# Altium schematic sheet IOs.SchDoc
size A4; SheetNumber: 3; SheetTotal: 3
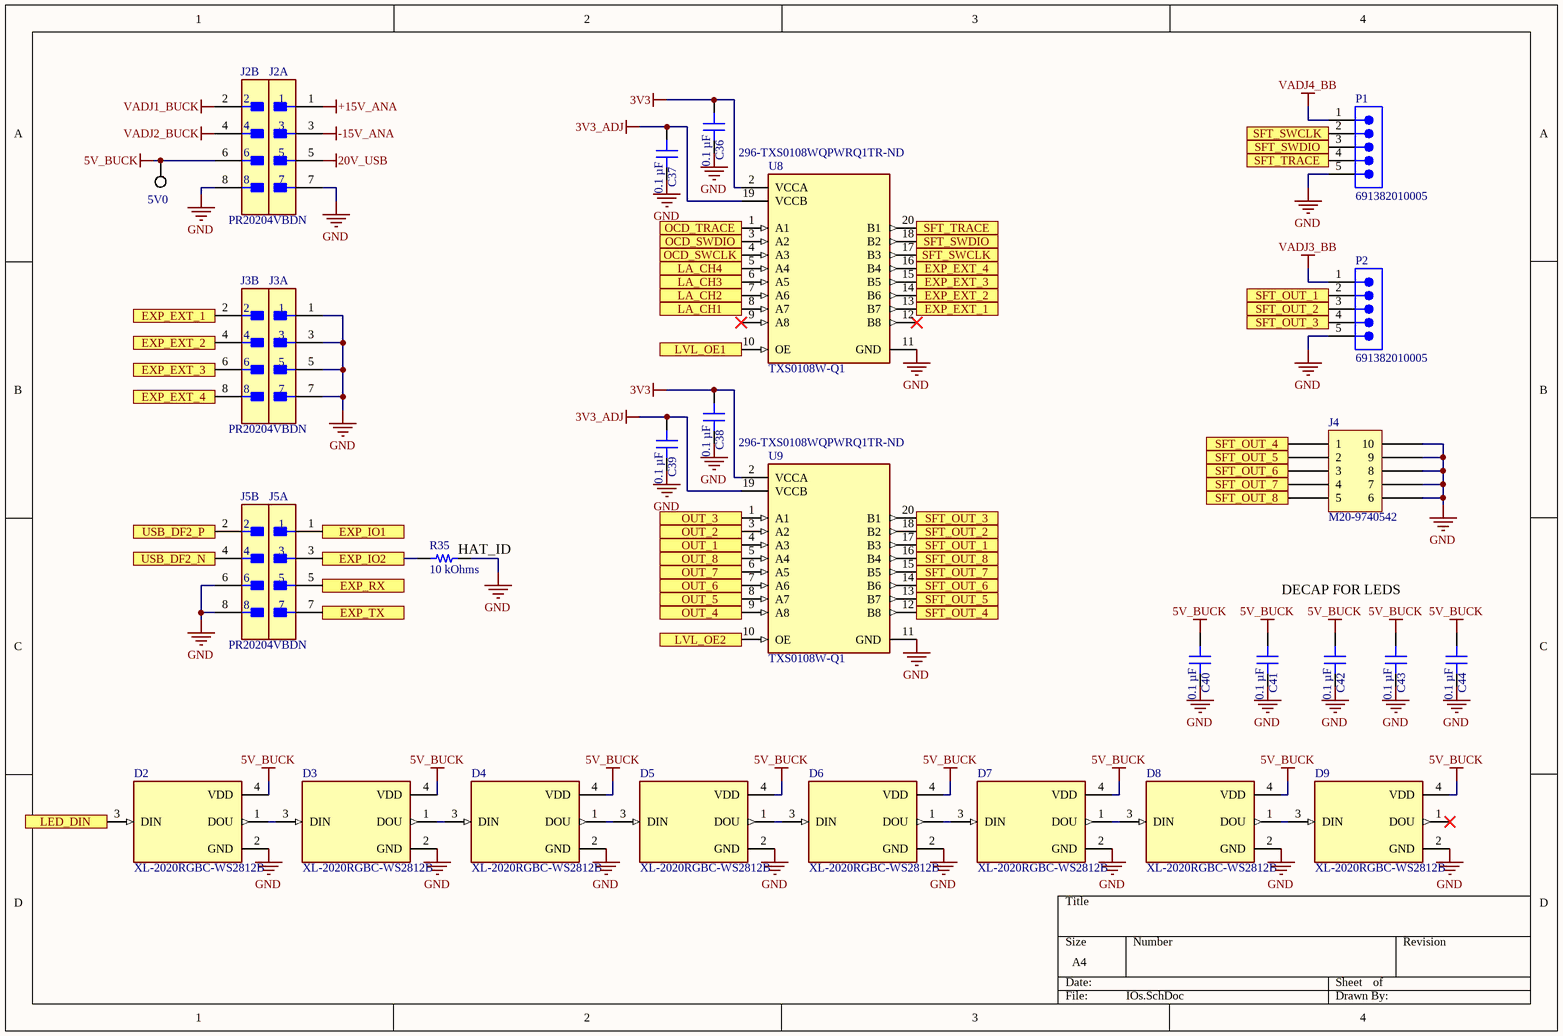
[diagram p0: IOs.SchDoc]

## Parts
5V0  TP_SMD_1  [TP_1.0mm]  (value not drawn)  (no BOM)
C36  0.1 µF  [CAP 0603_1608]
C37  0.1 µF  [CAP 0603_1608]
C38  0.1 µF  [CAP 0603_1608]
C39  0.1 µF  [CAP 0603_1608]
C40  0.1 µF  [CAP 0603_1608]
C41  0.1 µF  [CAP 0603_1608]
C42  0.1 µF  [CAP 0603_1608]
C43  0.1 µF  [CAP 0603_1608]
C44  0.1 µF  [CAP 0603_1608]
D2  XL-2020RGBC-WS2812B  [LED_XL-2020RGBC-WS2812B]
D3  XL-2020RGBC-WS2812B  [LED_XL-2020RGBC-WS2812B]
D4  XL-2020RGBC-WS2812B  [LED_XL-2020RGBC-WS2812B]
D5  XL-2020RGBC-WS2812B  [LED_XL-2020RGBC-WS2812B]
D6  XL-2020RGBC-WS2812B  [LED_XL-2020RGBC-WS2812B]
D7  XL-2020RGBC-WS2812B  [LED_XL-2020RGBC-WS2812B]
D8  XL-2020RGBC-WS2812B  [LED_XL-2020RGBC-WS2812B]
D9  XL-2020RGBC-WS2812B  [LED_XL-2020RGBC-WS2812B]
J2  PR20204VBDN  [FP-PR20204VBDN-MFG]  (parts A,B of 2)
J3  PR20204VBDN  [FP-PR20204VBDN-MFG]  (parts A,B of 2)
J4  M20-9740542  [HARWIN M20-9740545]
J5  PR20204VBDN  [FP-PR20204VBDN-MFG]  (parts A,B of 2)
P1  691382010005  [691382010005]
P2  691382010005  [691382010005]
R35  10 kOhms  [RES 0603_1608]
U8  TXS0108W-Q1  Supplier Part Number 1: 296-TXS0108WQPWRQ1TR-ND  [FP-PW0020A-IPC_C]
U9  TXS0108W-Q1  Supplier Part Number 1: 296-TXS0108WQPWRQ1TR-ND  [FP-PW0020A-IPC_C]

## Ports
EXP_EXT_1, EXP_EXT_2, EXP_EXT_3, EXP_EXT_4, EXP_IO1, EXP_IO2, EXP_RX, EXP_TX, LA_CH1, LA_CH2, LA_CH3, LA_CH4, LED_DIN, LVL_OE1, LVL_OE2, OCD_SWCLK, OCD_SWDIO, OCD_TRACE, OUT_1, OUT_2, OUT_3, OUT_4, OUT_5, OUT_6, OUT_7, OUT_8, SFT_OUT_1, SFT_OUT_2, SFT_OUT_3, SFT_OUT_4, SFT_OUT_5, SFT_OUT_6, SFT_OUT_7, SFT_OUT_8, SFT_SWCLK, SFT_SWDIO, SFT_TRACE, USB_DF2_N, USB_DF2_P

## Nets
3V3: C36.2 C38.2 U8.2(VCCA) U9.2(VCCA)
3V3_ADJ: C37.2 C39.2 U8.19(VCCB) U9.19(VCCB)
5V_BUCK: 5V0.1 C40.2 C41.2 C42.2 C43.2 C44.2 D2.4(VDD) D3.4(VDD) D4.4(VDD) D5.4(VDD) D6.4(VDD) D7.4(VDD) D8.4(VDD) D9.4(VDD) J2.6
20V_USB: J2.5
+15V_ANA: J2.1
-15V_ANA: J2.3
GND: C36.1 C37.1 C38.1 C39.1 C40.1 C41.1 C42.1 C43.1 C44.1 D2.2(GND) D3.2(GND) D4.2(GND) D5.2(GND) D6.2(GND) D7.2(GND) D8.2(GND) D9.2(GND) J2.7 J2.8 J3.1 J3.3 J3.5 J3.7 J4.6 J4.7 J4.8 J4.9 J4.10 J5.6 J5.8 P1.5 P2.5 R35.1 U8.11(GND) U9.11(GND)
VADJ1_BUCK: J2.2
VADJ2_BUCK: J2.4
VADJ3_BB: P2.1
VADJ4_BB: P1.1
EXP_EXT_1: J3.2 U8.13(B7) ; port EXP_EXT_1
EXP_EXT_2: J3.4 U8.14(B6) ; port EXP_EXT_2
EXP_EXT_3: J3.6 U8.15(B5) ; port EXP_EXT_3
EXP_EXT_4: J3.8 U8.16(B4) ; port EXP_EXT_4
EXP_IO1: J5.1 ; port EXP_IO1
EXP_IO2: J5.3 R35.2 ; port EXP_IO2
EXP_RX: J5.5 ; port EXP_RX
EXP_TX: J5.7 ; port EXP_TX
LA_CH1: U8.8(A7) ; port LA_CH1
LA_CH2: U8.7(A6) ; port LA_CH2
LA_CH3: U8.6(A5) ; port LA_CH3
LA_CH4: U8.5(A4) ; port LA_CH4
LED_DIN: D2.3(DIN) ; port LED_DIN
LVL_OE1: U8.10(OE) ; port LVL_OE1
LVL_OE2: U9.10(OE) ; port LVL_OE2
OCD_SWCLK: U8.4(A3) ; port OCD_SWCLK
OCD_SWDIO: U8.3(A2) ; port OCD_SWDIO
OCD_TRACE: U8.1(A1) ; port OCD_TRACE
OUT_1: U9.4(A3) ; port OUT_1
OUT_2: U9.3(A2) ; port OUT_2
OUT_3: U9.1(A1) ; port OUT_3
OUT_4: U9.9(A8) ; port OUT_4
OUT_5: U9.8(A7) ; port OUT_5
OUT_6: U9.7(A6) ; port OUT_6
OUT_7: U9.6(A5) ; port OUT_7
OUT_8: U9.5(A4) ; port OUT_8
SFT_OUT_1: P2.2 U9.17(B3) ; port SFT_OUT_1
SFT_OUT_2: P2.3 U9.18(B2) ; port SFT_OUT_2
SFT_OUT_3: P2.4 U9.20(B1) ; port SFT_OUT_3
SFT_OUT_4: J4.1 U9.12(B8) ; port SFT_OUT_4
SFT_OUT_5: J4.2 U9.13(B7) ; port SFT_OUT_5
SFT_OUT_6: J4.3 U9.14(B6) ; port SFT_OUT_6
SFT_OUT_7: J4.4 U9.15(B5) ; port SFT_OUT_7
SFT_OUT_8: J4.5 U9.16(B4) ; port SFT_OUT_8
SFT_SWCLK: P1.2 U8.17(B3) ; port SFT_SWCLK
SFT_SWDIO: P1.3 U8.18(B2) ; port SFT_SWDIO
SFT_TRACE: P1.4 U8.20(B1) ; port SFT_TRACE
USB_DF2_N: J5.4 ; port USB_DF2_N
USB_DF2_P: J5.2 ; port USB_DF2_P
NetD2_1: D2.1(DOU) D3.3(DIN)
NetD3_1: D3.1(DOU) D4.3(DIN)
NetD4_1: D4.1(DOU) D5.3(DIN)
NetD5_1: D5.1(DOU) D6.3(DIN)
NetD6_1: D6.1(DOU) D7.3(DIN)
NetD7_1: D7.1(DOU) D8.3(DIN)
NetD8_1: D8.1(DOU) D9.3(DIN)

Not connected (* = marked no-connect by the designer): D9 1(DOU)*; U8 9(A8)* 12(B8)*

## Notes on the sheet
- (near R35) HAT_ID
- DECAP FOR LEDS

## Library data of the parts
C36-C44 = CGA3E2X7R1H104M080AE: CAP CER 0.1UF 50V X7R 0603; manufacturer: TDK Corporation; Tolerance: ±20%; Part Number: CGA3E2X7R1H104M080AE; Value: 0.1 µF; Applications: Automotive, Boardflex Sensitive; Capacitance: 0.1 µF; componentlink1description: Datasheet; componentlink1url: https://product.tdk.com/info/en/catalog/datasheets/mlcc_automotive_soft_en.pdf?ref_disty=digikey; componentlink2description: DigiKey Link; componentlink2url: https://www.digikey.com/en/products/detail/tdk-corporation/CGA3E2X7R1H104M080AE/4490595; Device Package: 0603 (1608 Metric); Features: Soft Termination; lastupdated: 09/02/2024 20:10:15; Lifecycle Status: Active; Minimum Order: 1; Mounting Type: Surface Mount, MLCC; Operating Temperature: -55°C ~ 125°C; Package / Case: 0603 (1608 Metric); packaging: TapeAndReel; partid: 13634; Part Status: Active; price: 0.03; Ratings: AEC-Q200; series: CGA; Size / Dimension: 0.063" L x 0.031" W (1.60mm x 0.80mm); Supplier 1: DigiKey; Supplier Part Number 1: 445-15958-1-ND; Temperature Coefficient: X7R; Thickness (Max): 0.037" (0.95mm); Voltage - Rated: 50V
D2-D9 = XL-2020RGBC-WS2812B: 2020 RGB LED(BUILT-IN IC); MF: XINGLIGHT; SnapEDA_Link: https://www.snapeda.com/parts/XL-2020RGBC-WS2812B/Xinglight/view-part/?ref=snap; Package: None; Value: *; MP: XL-2020RGBC-WS2812B; Check_prices: https://www.snapeda.com/parts/XL-2020RGBC-WS2812B/Xinglight/view-part/?ref=eda
J2 J3 J5 = CMP-77940-000004-1: PIN HEADER, THR, DUAL ROW, .100"
J4 = M20-9740542: CONN HEADER R/A 10POS 2.54MM; Manufacturer: Harwin Inc.; Connector Type: Header, Cuttable; Contact Length - Mating: 0.228" (5.80mm); Contact Length - Post: 0.118" (3.00mm); Current Rating (Amps): 3A per Contact; Material Flammability Rating: UL94 V-0; Number of Positions: 10; Number of Positions Loaded: All; Pitch - Mating: 0.100" (2.54mm); Shrouding: Unshrouded; Style: Board to Board or Cable; Part Number: M20-9740542; ComponentLink1Description: Datasheet; ComponentLink1URL: https://cdn.harwin.com/pdfs/Harwin_PC_Connectors_M20.pdf; ComponentLink2Description: DigiKey Link; ComponentLink2URL: https://www.digikey.com/en/products/detail/harwin-inc/M20-9740542/3920716; Contact Finish - Mating: Gold; Contact Finish - Post: Tin; Contact Material: Brass; Contact Shape: Square; Contact Type: Male Pin; Fastening Type: Push-Pull; Insulation Color: Black; Insulation Height: 0.200" (5.08mm); Insulation Material: Polyamide (PA6T), Nylon 6T; LastUpdated: 21/09/2022 19:18:08; Lifecycle Status: Active; Minimum Order: 1; Mounting Type: Through Hole, Right Angle; Number of Rows: 2; Operating Temperature: -40°C ~ 105°C; Packaging: Bulk; PartId: 158; Part Status: Active; Price: 0.24; Row Spacing - Mating: 0.100" (2.54mm); Series: M20; Supplier 1: DigiKey; Supplier Part Number 1: 952-3274-ND; Termination: Solder
P1 P2 = CMP-1502-01746-3: Terminal Block, R/A Header, 5Pos, Th Rohs Compliant: Yes; Number of Positions Per Level: 5; Gender: Male; Pitch: 2.4892mm; Current: 12A; Voltage: 300V; Number of Levels: 1; Lead Pitch: 2.5mm; Packaging: Box; Termination: Solder; Min Operating Temperature: -40°C; Number of Pins: 5; Color: Green; RoHS: Compliant; Number of Positions: 5; Max Operating Temperature: 105°C; Mount: Through Hole; Contact Plating: Tin
R35 = SG73S1JTTD1002F: RES 10K OHM 1% 1/5W 0603; Manufacturer: KOA Speer Electronics, Inc.; Power (Watts): 0.2W, 1/5W; Temperature Coefficient: ±100ppm/°C; Part Number: SG73S1JTTD1002F; Value: 10 kOhms; ComponentLink1Description: Datasheet; ComponentLink1URL: http://www.koaspeer.com/catimages/Products/SG73S/SG73S.pdf; ComponentLink2Description: DigiKey Link; ComponentLink2URL: https://www.digikey.com/en/products/detail/koa-speer-electronics-inc/SG73S1JTTD1002F/10279969; Composition: Thick Film; Device Package: 0603 (1608 Metric); Features: Automotive AEC-Q200, Moisture Resistant, Pulse Withstanding; Height - Seated (Max): 0.022" (0.55mm); LastUpdated: 09/02/2024 20:43:35; Lifecycle Status: Active; Minimum Order: 1; Number of Terminations: 2; Operating Temperature: -55°C ~ 155°C; Package / Case: 0603 (1608 Metric); Packaging: TapeAndReel; PartId: 5386; Part Status: Active; Price: 0.01; Ratings: AEC-Q200; Resistance: 10 kOhms; Series: SG73S; Size / Dimension: 0.063" L x 0.031" W (1.60mm x 0.80mm); Supplier 1: DigiKey; Supplier Part Number 1: 2019-SG73S1JTTD1002FCT-ND; Supplier Device Package: 0603; Tolerance: ±1%
U8 U9 = CMP-2000-04956-2: IC TRNSLTR BIDIRECTIONAL 20TSSOP; Number of Inputs: 8; Supply Current: 8uA; Low Level Output Current: 50mA; Min Supply Voltage: 1.2V; Quiescent Current: 3uA; Output Type: Voltage; Propagation Delay: 4.8ns; Max Supply Voltage: 5.5V; Output Current: 620uA; Turn-On Delay Time: 312ns; Logic Function: Translator; Data Rate: 60Mbps; Rise Time: 6.3ns; High Level Output Current: -50mA; Number of Pins: 20; Packaging: Tape and Reel; Max Operating Temperature: 85°C; Height: 1.15mm; Nominal Supply Current: 8uA; Termination: SMD/SMT; Lead Free: Lead Free; Package Quantity: 1; Number of Bits: 8; Weight: 0.002716oz; Contact Plating: Gold; Series: -; Width: 4.4mm; Radiation Hardening: No; Mount: Surface Mount; Length: 6.5mm; Case/Package: TSSOP; REACH SVHC: No SVHC; RoHS Compliant: Yes; Min Operating Temperature: -40°C; Number of Channels: 8; Supplier 1: DigiKey